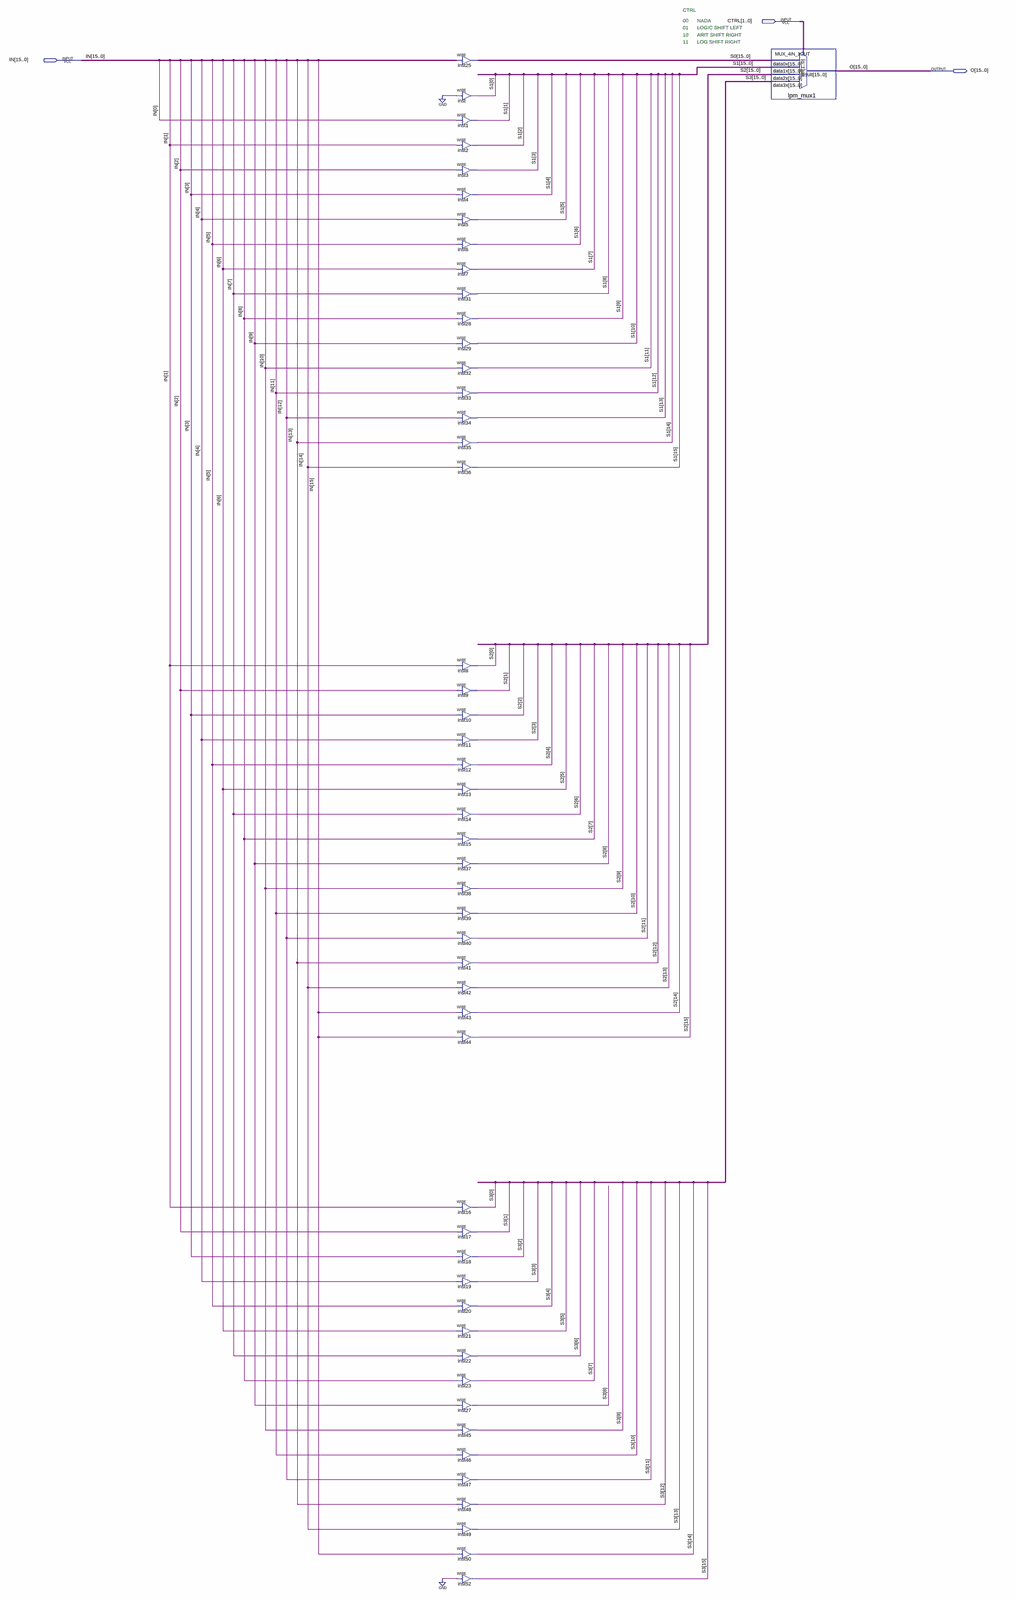
[diagram p0: schematic sheet, whole]
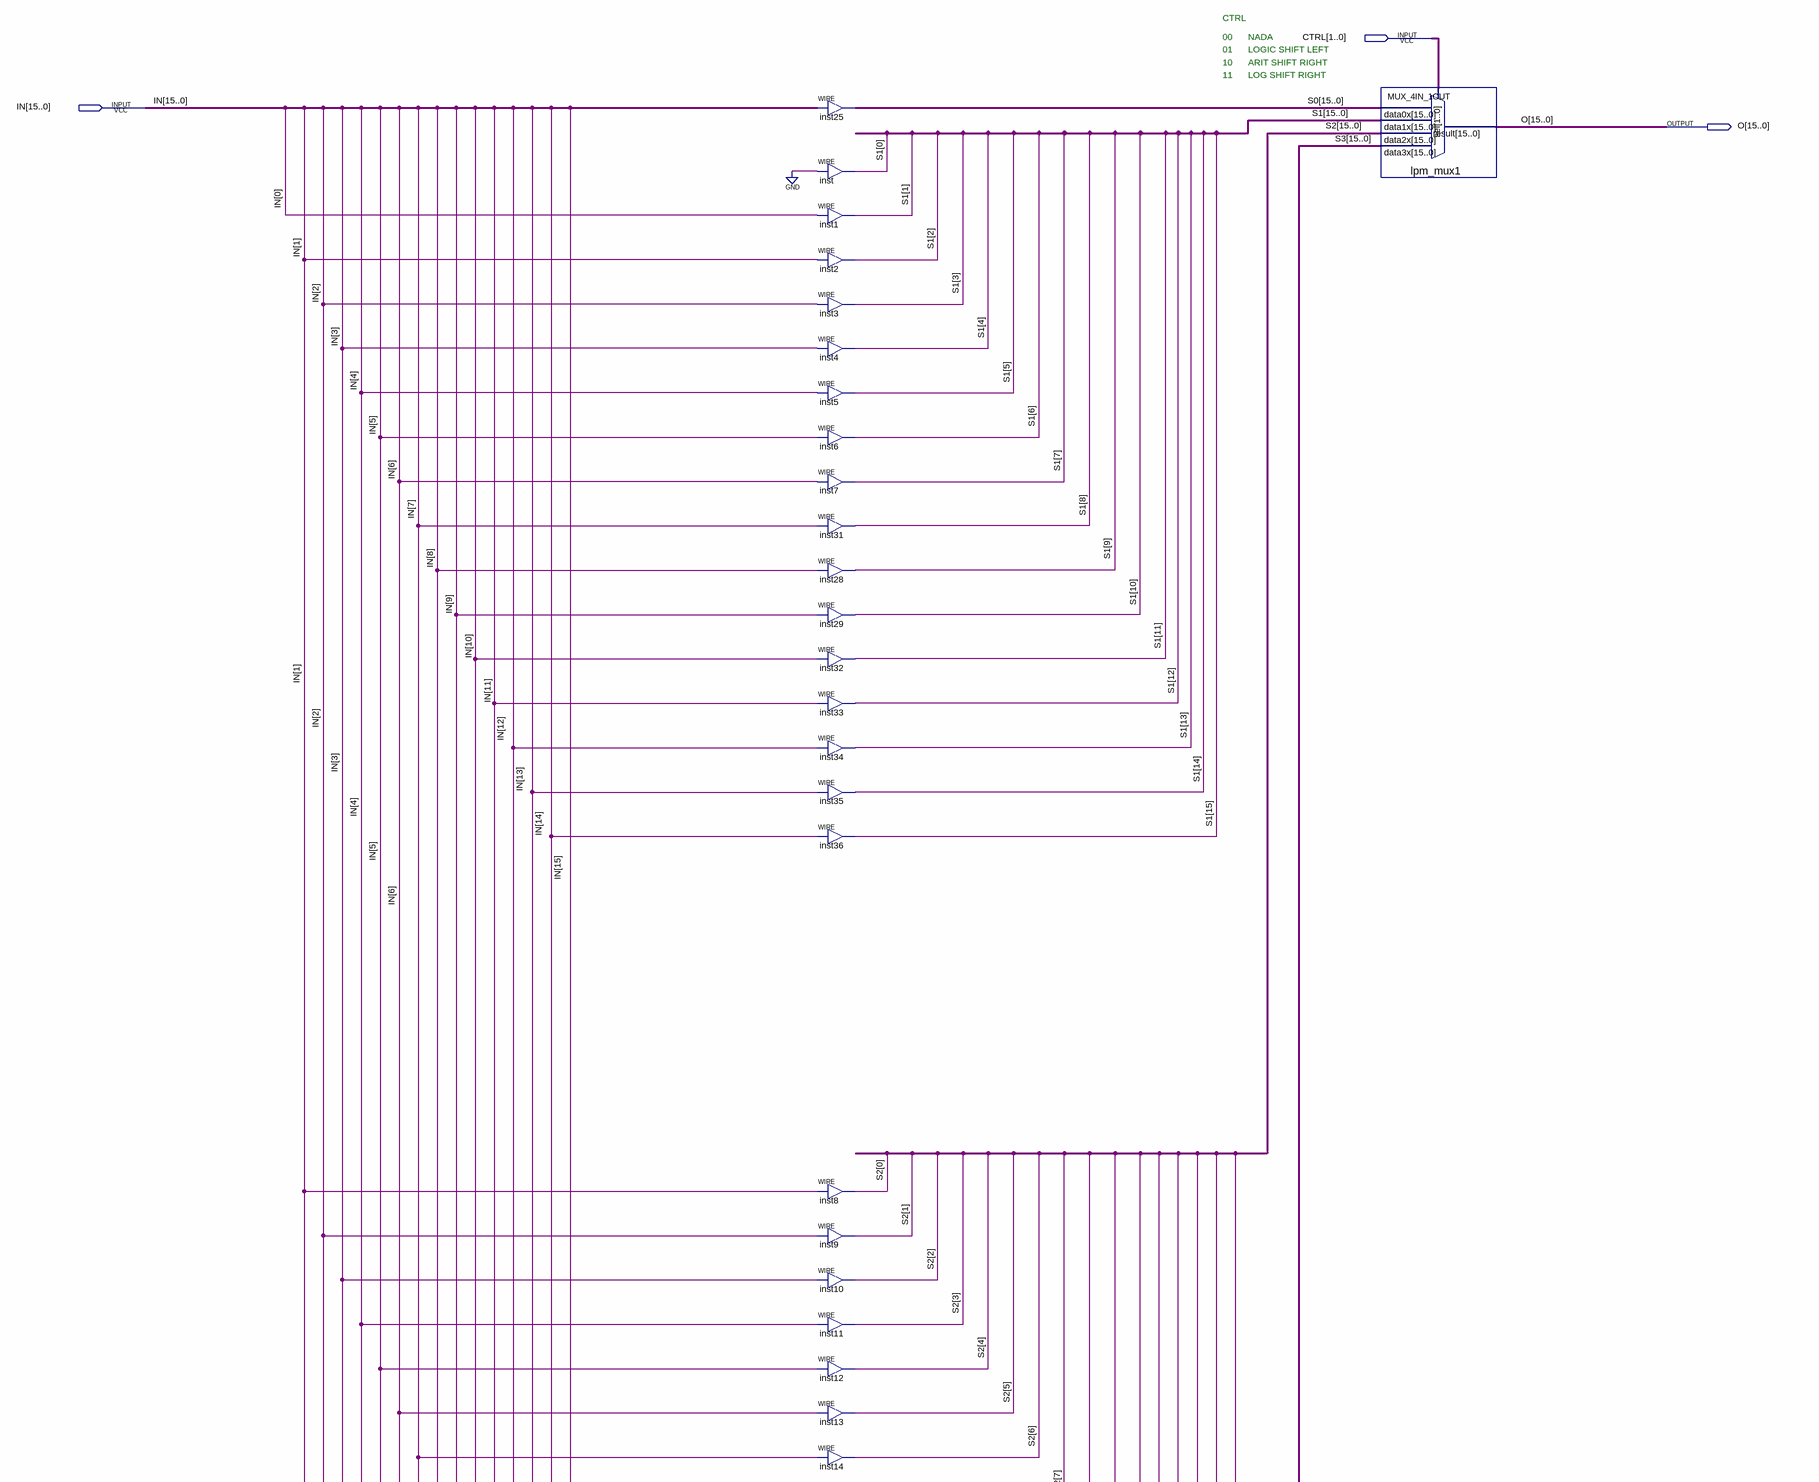
[diagram p1: schematic sheet, upper part]
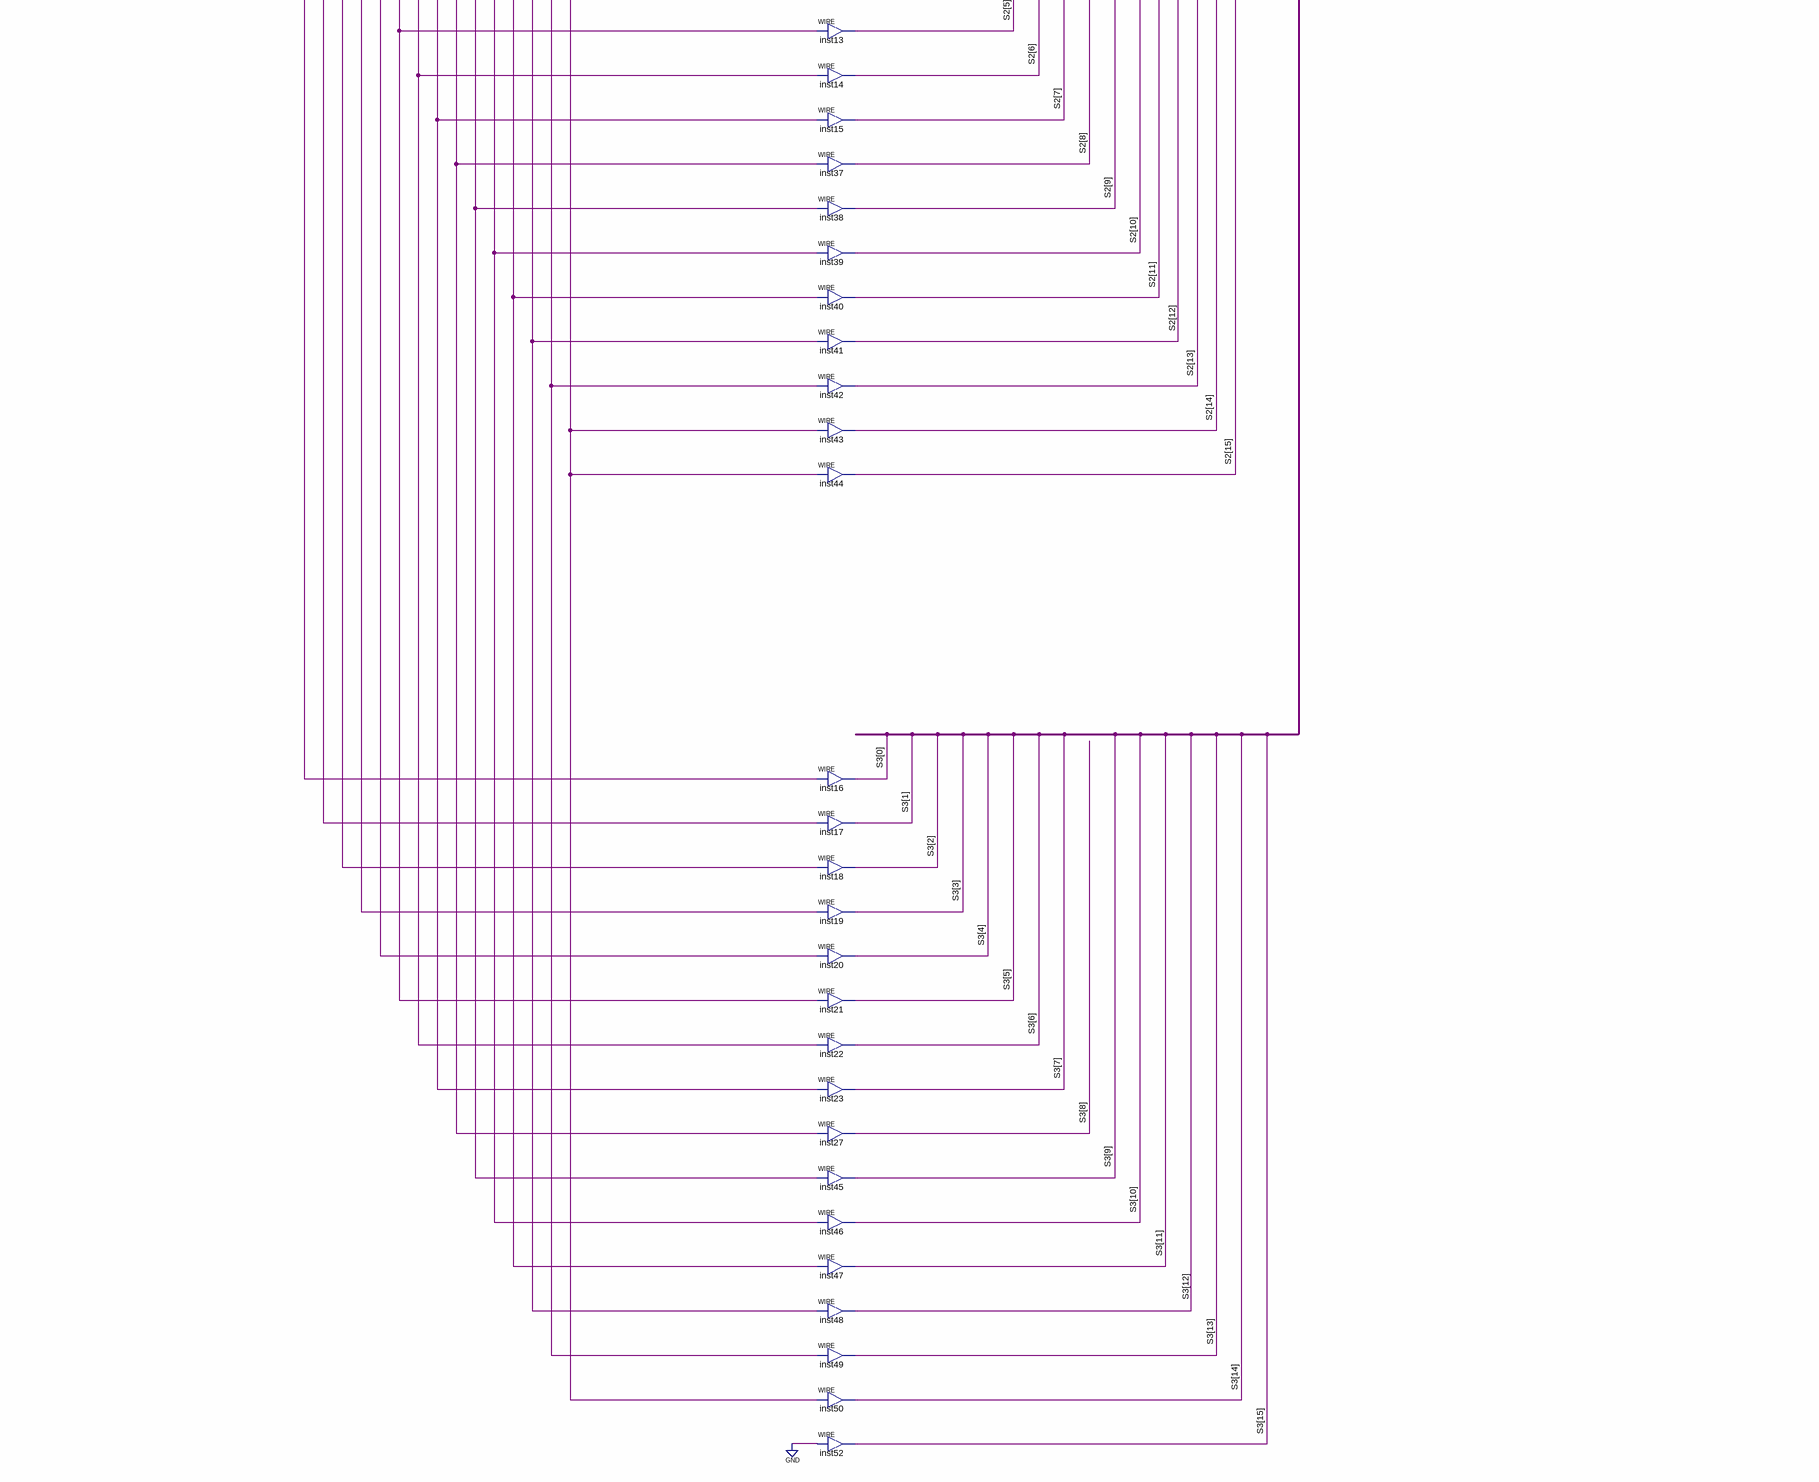
[diagram p2: schematic sheet, lower part]
// Quartus schematic shifter16Bits.bdf as structural Verilog: 50 symbols, 3 pins
module shifter16Bits (
  input  [1:0] CTRL,
  input  [15:0] IN,
  output [15:0] O
);

  wire [15:0] S0, S1, S2, S3;

  assign S0 = IN;  // WIRE inst25
  assign S1[0] = 1'b0;  // WIRE inst
  assign S1[1] = IN[0];  // WIRE inst1
  assign S1[2] = IN[1];  // WIRE inst2
  assign S1[3] = IN[2];  // WIRE inst3
  assign S1[4] = IN[3];  // WIRE inst4
  assign S1[5] = IN[4];  // WIRE inst5
  assign S1[6] = IN[5];  // WIRE inst6
  assign S1[7] = IN[6];  // WIRE inst7
  assign S1[8] = IN[7];  // WIRE inst31
  assign S1[9] = IN[8];  // WIRE inst28
  assign S1[10] = IN[9];  // WIRE inst29
  assign S1[11] = IN[10];  // WIRE inst32
  assign S1[12] = IN[11];  // WIRE inst33
  assign S1[13] = IN[12];  // WIRE inst34
  assign S1[14] = IN[13];  // WIRE inst35
  assign S1[15] = IN[14];  // WIRE inst36
  assign S2[0] = IN[1];  // WIRE inst8
  assign S2[1] = IN[2];  // WIRE inst9
  assign S2[2] = IN[3];  // WIRE inst10
  assign S2[3] = IN[4];  // WIRE inst11
  assign S2[4] = IN[5];  // WIRE inst12
  assign S2[5] = IN[6];  // WIRE inst13
  assign S2[6] = IN[7];  // WIRE inst14
  assign S2[7] = IN[8];  // WIRE inst15
  assign S2[8] = IN[9];  // WIRE inst37
  assign S2[9] = IN[10];  // WIRE inst38
  assign S2[10] = IN[11];  // WIRE inst39
  assign S2[11] = IN[12];  // WIRE inst40
  assign S2[12] = IN[13];  // WIRE inst41
  assign S2[13] = IN[14];  // WIRE inst42
  assign S2[14] = IN[15];  // WIRE inst43
  assign S2[15] = IN[15];  // WIRE inst44
  assign S3[0] = IN[1];  // WIRE inst16
  assign S3[1] = IN[2];  // WIRE inst17
  assign S3[2] = IN[3];  // WIRE inst18
  assign S3[3] = IN[4];  // WIRE inst19
  assign S3[4] = IN[5];  // WIRE inst20
  assign S3[5] = IN[6];  // WIRE inst21
  assign S3[6] = IN[7];  // WIRE inst22
  assign S3[7] = IN[8];  // WIRE inst23
  assign S3[8] = IN[9];  // WIRE inst27
  assign S3[9] = IN[10];  // WIRE inst45
  assign S3[10] = IN[11];  // WIRE inst46
  assign S3[11] = IN[12];  // WIRE inst47
  assign S3[12] = IN[13];  // WIRE inst48
  assign S3[13] = IN[14];  // WIRE inst49
  assign S3[14] = IN[15];  // WIRE inst50
  assign S3[15] = 1'b0;  // WIRE inst52
  lpm_mux1 MUX_4IN_1OUT (.data3x(S3), .data2x(S2), .data1x(S1), .data0x(S0), .sel(CTRL), .result(O));

  // Notes on the sheet:
  //   CTRL 
  //   00
  //   NADA
  //   01
  //   LOGIC SHIFT LEFT
  //   10
  //   ARIT SHIFT RIGHT
  //   11
  //   LOG SHIFT RIGHT
endmodule
